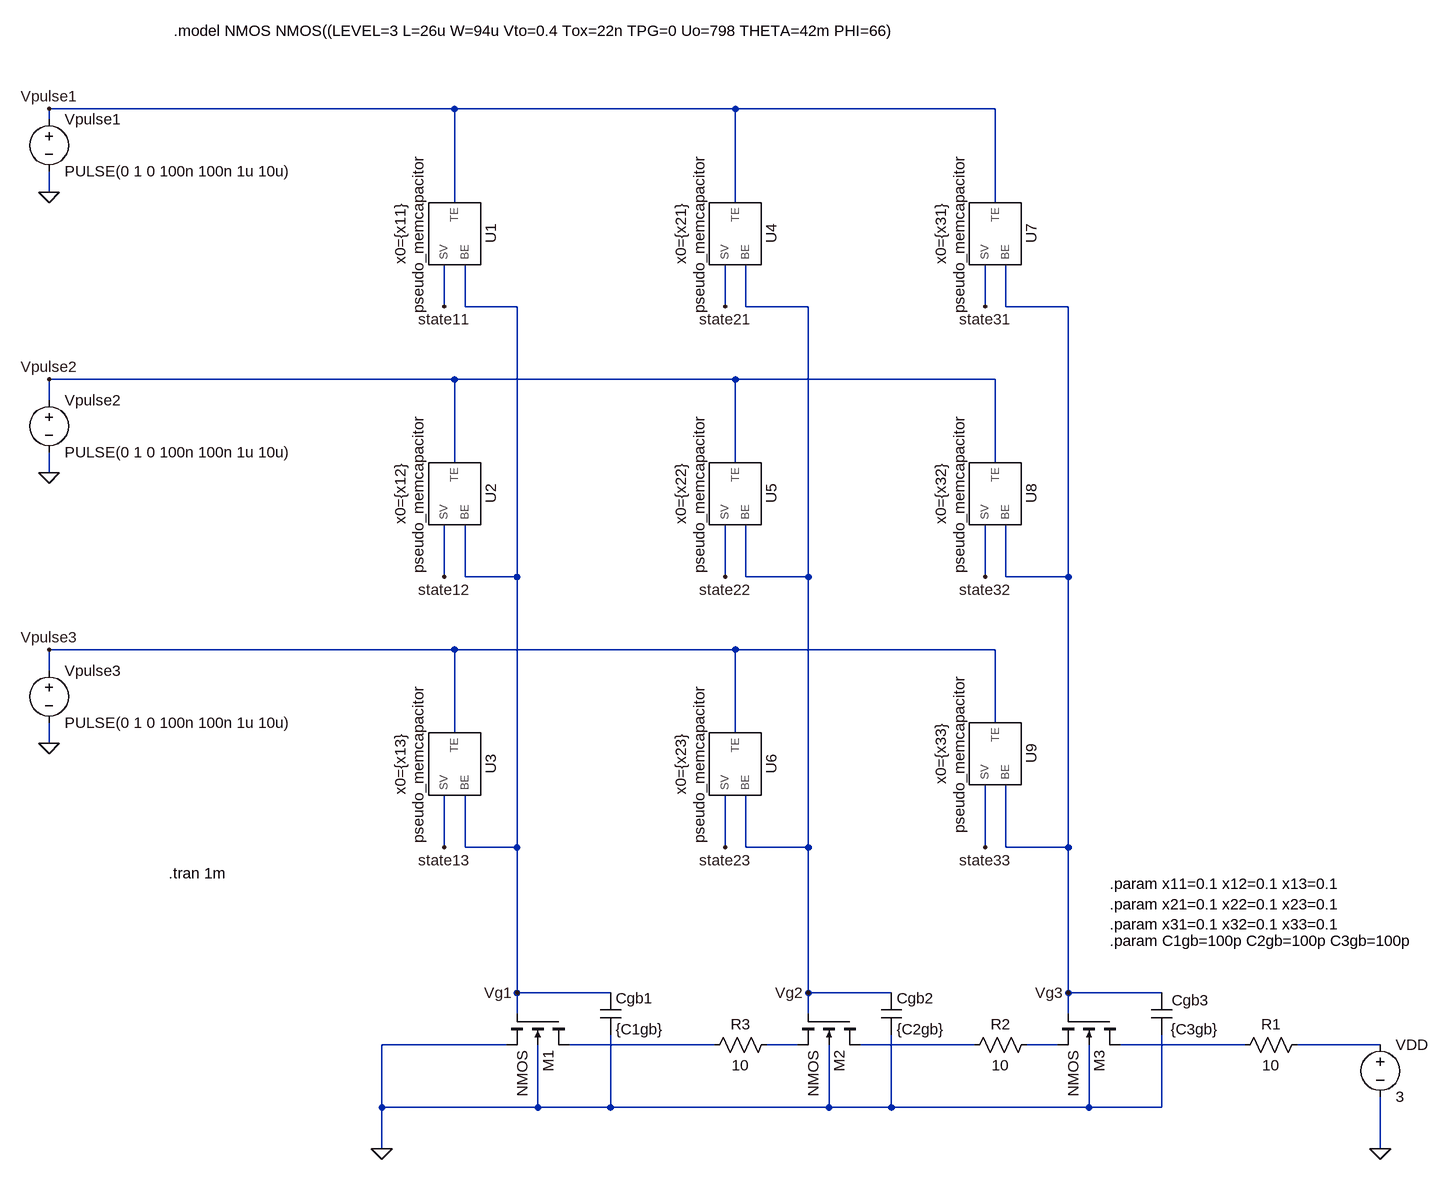
[diagram p0: schematic neuro_memristor_3x3.asc]
neuro_memristor_3x3.asc, the LTspice schematic file:
Version 4
SHEET 1 2604 1572
WIRE 864 -208 240 -208
WIRE 1296 -208 864 -208
WIRE 1696 -208 1296 -208
WIRE 240 -192 240 -208
WIRE 240 -80 240 -112
WIRE 864 -64 864 -208
WIRE 1296 -64 1296 -208
WIRE 1696 -64 1696 -208
WIRE 848 96 848 32
WIRE 880 96 880 32
WIRE 960 96 880 96
WIRE 1280 96 1280 32
WIRE 1312 96 1312 32
WIRE 1408 96 1312 96
WIRE 1680 96 1680 32
WIRE 1712 96 1712 32
WIRE 1808 96 1712 96
WIRE 864 208 240 208
WIRE 1296 208 864 208
WIRE 1696 208 1296 208
WIRE 240 240 240 208
WIRE 864 336 864 208
WIRE 1296 336 1296 208
WIRE 1696 336 1696 208
WIRE 240 352 240 320
WIRE 848 512 848 432
WIRE 880 512 880 432
WIRE 960 512 960 96
WIRE 960 512 880 512
WIRE 1280 512 1280 432
WIRE 1312 512 1312 432
WIRE 1408 512 1408 96
WIRE 1408 512 1312 512
WIRE 1680 512 1680 432
WIRE 1712 512 1712 432
WIRE 1808 512 1808 96
WIRE 1808 512 1712 512
WIRE 864 624 240 624
WIRE 1296 624 864 624
WIRE 1696 624 1296 624
WIRE 240 656 240 624
WIRE 1696 736 1696 624
WIRE 864 752 864 624
WIRE 1296 752 1296 624
WIRE 240 768 240 736
WIRE 848 928 848 848
WIRE 880 928 880 848
WIRE 960 928 960 512
WIRE 960 928 880 928
WIRE 1280 928 1280 848
WIRE 1312 928 1312 848
WIRE 1408 928 1408 512
WIRE 1408 928 1312 928
WIRE 1680 928 1680 832
WIRE 1712 928 1712 832
WIRE 1808 928 1808 512
WIRE 1808 928 1712 928
WIRE 960 1152 960 928
WIRE 1104 1152 960 1152
WIRE 1408 1152 1408 928
WIRE 1536 1152 1408 1152
WIRE 1808 1152 1808 928
WIRE 1952 1152 1808 1152
WIRE 960 1184 960 1152
WIRE 1408 1184 1408 1152
WIRE 1808 1184 1808 1152
WIRE 944 1232 752 1232
WIRE 1264 1232 1040 1232
WIRE 1392 1232 1344 1232
WIRE 1664 1232 1488 1232
WIRE 1792 1232 1744 1232
WIRE 2080 1232 1888 1232
WIRE 2288 1232 2160 1232
WIRE 752 1328 752 1232
WIRE 992 1328 992 1232
WIRE 992 1328 752 1328
WIRE 1104 1328 1104 1216
WIRE 1104 1328 992 1328
WIRE 1440 1328 1440 1232
WIRE 1440 1328 1104 1328
WIRE 1536 1328 1536 1216
WIRE 1536 1328 1440 1328
WIRE 1840 1328 1840 1232
WIRE 1840 1328 1536 1328
WIRE 1952 1328 1952 1216
WIRE 1952 1328 1840 1328
WIRE 752 1392 752 1328
WIRE 2288 1392 2288 1312
FLAG 240 -80 0
FLAG 2288 1392 0
FLAG 848 96 state11
FLAG 1808 1152 Vg3
FLAG 240 -208 Vpulse1
FLAG 848 512 state12
FLAG 848 928 state13
FLAG 240 352 0
FLAG 240 768 0
FLAG 240 208 Vpulse2
FLAG 240 624 Vpulse3
FLAG 1408 1152 Vg2
FLAG 960 1152 Vg1
FLAG 1280 96 state21
FLAG 1280 512 state22
FLAG 1280 928 state23
FLAG 1680 96 state31
FLAG 1680 512 state32
FLAG 1680 928 state33
FLAG 752 1392 0
SYMBOL voltage 240 -208 R0
WINDOW 123 0 0 Left 0
WINDOW 39 0 0 Left 0
SYMATTR InstName Vpulse1
SYMATTR Value PULSE(0 1 0 100n 100n 1u 10u)
SYMBOL voltage 2288 1216 R0
WINDOW 123 0 0 Left 0
WINDOW 39 0 0 Left 0
SYMATTR InstName VDD
SYMATTR Value 3
SYMBOL nmos4 1888 1184 R90
SYMATTR InstName M3
SYMBOL cap 1936 1152 R0
WINDOW 0 31 11 Left 2
WINDOW 3 30 56 Left 2
SYMATTR InstName Cgb3
SYMATTR Value {C3gb}
SYMBOL voltage 240 224 R0
SYMATTR InstName Vpulse2
SYMATTR Value PULSE(0 1 0 100n 100n 1u 10u)
SYMBOL voltage 240 640 R0
SYMATTR InstName Vpulse3
SYMATTR Value PULSE(0 1 0 100n 100n 1u 10u)
SYMBOL pseudo_memcapacitor 864 -16 R90
WINDOW 123 0 68 Top 2
SYMATTR Value2 x0={x11}
SYMATTR InstName U1
SYMBOL pseudo_memcapacitor 864 384 R90
WINDOW 123 0 68 Top 2
SYMATTR Value2 x0={x12}
SYMATTR InstName U2
SYMBOL pseudo_memcapacitor 864 800 R90
WINDOW 123 0 68 Top 2
SYMATTR Value2 x0={x13}
SYMATTR InstName U3
SYMBOL pseudo_memcapacitor 1296 -16 R90
WINDOW 123 0 68 Top 2
SYMATTR Value2 x0={x21}
SYMATTR InstName U4
SYMBOL pseudo_memcapacitor 1296 384 R90
WINDOW 123 0 68 Top 2
SYMATTR Value2 x0={x22}
SYMATTR InstName U5
SYMBOL pseudo_memcapacitor 1296 800 R90
WINDOW 123 0 68 Top 2
SYMATTR Value2 x0={x23}
SYMATTR InstName U6
SYMBOL pseudo_memcapacitor 1696 -16 R90
WINDOW 123 0 68 Top 2
SYMATTR Value2 x0={x31}
SYMATTR InstName U7
SYMBOL pseudo_memcapacitor 1696 384 R90
WINDOW 123 0 68 Top 2
SYMATTR Value2 x0={x32}
SYMATTR InstName U8
SYMBOL pseudo_memcapacitor 1696 784 R90
WINDOW 123 0 68 Top 2
SYMATTR Value2 x0={x33}
SYMATTR InstName U9
SYMBOL nmos4 1488 1184 R90
SYMATTR InstName M2
SYMBOL nmos4 1040 1184 R90
SYMATTR InstName M1
SYMBOL cap 1520 1152 R0
SYMATTR InstName Cgb2
SYMATTR Value {C2gb}
SYMBOL cap 1088 1152 R0
SYMATTR InstName Cgb1
SYMATTR Value {C1gb}
SYMBOL res 2176 1216 R90
WINDOW 0 0 56 VBottom 2
WINDOW 3 32 56 VTop 2
SYMATTR InstName R1
SYMATTR Value 10
SYMBOL res 1760 1216 R90
WINDOW 0 0 56 VBottom 2
WINDOW 3 32 56 VTop 2
SYMATTR InstName R2
SYMATTR Value 10
SYMBOL res 1360 1216 R90
WINDOW 0 0 56 VBottom 2
WINDOW 3 32 56 VTop 2
SYMATTR InstName R3
SYMATTR Value 10
TEXT 424 968 Left 2 !.tran 1m
TEXT 432 -328 Left 2 !.model NMOS NMOS((LEVEL=3 L=26u W=94u Vto=0.4 Tox=22n TPG=0 Uo=798 THETA=42m PHI=66)
TEXT 1872 984 Left 2 !.param x11=0.1 x12=0.1 x13=0.1\n.param x21=0.1 x22=0.1 x23=0.1\n.param x31=0.1 x32=0.1 x33=0.1
TEXT 1872 1072 Left 2 !.param C1gb=100p C2gb=100p C3gb=100p

The netlist it stands for:
* neuro_memristor_3x3.asc
Vpulse1 Vpulse1 0 PULSE(0 1 0 100n 100n 1u 10u)
VDD N006 0 3
M3 N005 Vg3 N004 0 NMOS
Cgb3 Vg3 0 {C3gb}
Vpulse2 Vpulse2 0 PULSE(0 1 0 100n 100n 1u 10u)
Vpulse3 Vpulse3 0 PULSE(0 1 0 100n 100n 1u 10u)
XU1 Vpulse1 Vg1 state11 pseudo_memcapacitor x0={x11}  ; pins TE BE SV
XU2 Vpulse2 Vg1 state12 pseudo_memcapacitor x0={x12}  ; pins TE BE SV
XU3 Vpulse3 Vg1 state13 pseudo_memcapacitor x0={x13}  ; pins TE BE SV
XU4 Vpulse1 Vg2 state21 pseudo_memcapacitor x0={x21}  ; pins TE BE SV
XU5 Vpulse2 Vg2 state22 pseudo_memcapacitor x0={x22}  ; pins TE BE SV
XU6 Vpulse3 Vg2 state23 pseudo_memcapacitor x0={x23}  ; pins TE BE SV
XU7 Vpulse1 Vg3 state31 pseudo_memcapacitor x0={x31}  ; pins TE BE SV
XU8 Vpulse2 Vg3 state32 pseudo_memcapacitor x0={x32}  ; pins TE BE SV
XU9 Vpulse3 Vg3 state33 pseudo_memcapacitor x0={x33}  ; pins TE BE SV
M2 N003 Vg2 N002 0 NMOS
M1 N001 Vg1 0 0 NMOS
Cgb2 Vg2 0 {C2gb}
Cgb1 Vg1 0 {C1gb}
R1 N006 N005 10
R2 N004 N003 10
R3 N002 N001 10
.model NMOS NMOS
.model PMOS PMOS
.lib standard.mos
.tran 1m
.model NMOS NMOS((LEVEL=3 L=26u W=94u Vto=0.4 Tox=22n TPG=0 Uo=798 THETA=42m PHI=66)
.param x11=0.1 x12=0.1 x13=0.1
.param x21=0.1 x22=0.1 x23=0.1
.param x31=0.1 x32=0.1 x33=0.1
.param C1gb=100p C2gb=100p C3gb=100p
.lib .\pseudo_memcapacitor.cir
.backanno
.end